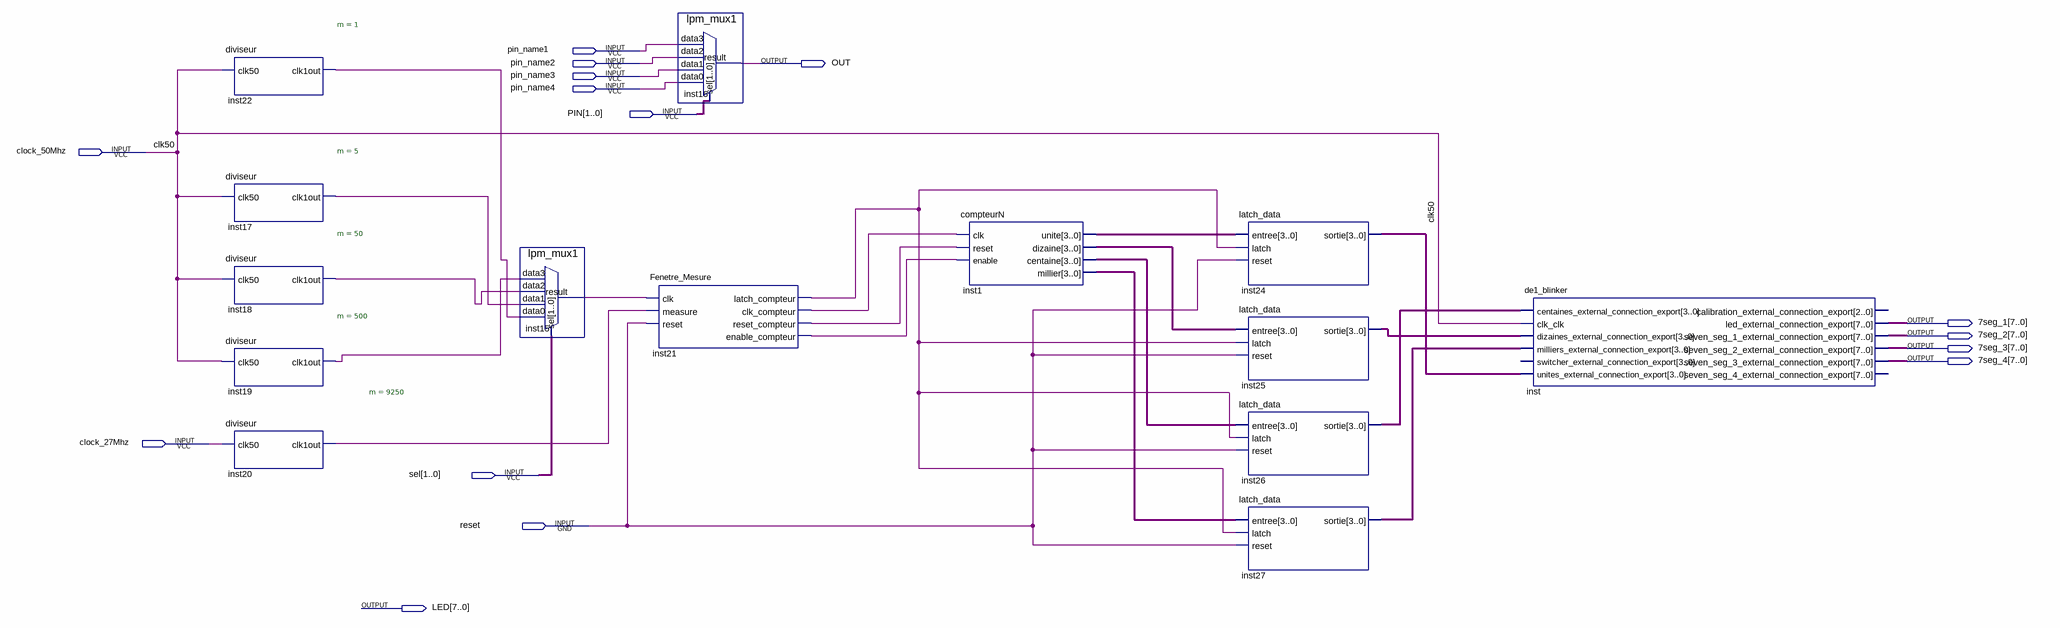
[diagram p0: schematic sheet]
// Quartus schematic Blinker_Schema.bdf as structural Verilog: 14 symbols, 15 pins
module Blinker_Schema (
  input  pin_name1,
  input  pin_name2,
  input  pin_name3,
  input  pin_name4,
  input  [1:0] PIN,
  input  clock_50Mhz,
  input  clock_27Mhz,
  input  [1:0] sel,
  input  reset,
  output OUT,
  output [7:0] \7seg_1 ,
  output [7:0] \7seg_2 ,
  output [7:0] \7seg_3 ,
  output [7:0] \7seg_4 ,
  output [7:0] LED
);

  wire inst15_result, inst17_clk1out, inst18_clk1out, inst19_clk1out, inst20_clk1out, inst21_clk_compteur,
       inst21_enable_compteur, inst21_latch_compteur, inst21_reset_compteur, inst22_clk1out;
  wire [3:0] inst1_centaine, inst1_dizaine, inst1_millier, inst1_unite, inst24_sortie, inst25_sortie,
       inst26_sortie, inst27_sortie;

  diviseur #(.m(1)) inst22 (.clk50(clock_50Mhz), .clk1out(inst22_clk1out));
  diviseur #(.m(5)) inst17 (.clk50(clock_50Mhz), .clk1out(inst17_clk1out));
  diviseur #(.m(50)) inst18 (.clk50(clock_50Mhz), .clk1out(inst18_clk1out));
  diviseur #(.m(500)) inst19 (.clk50(clock_50Mhz), .clk1out(inst19_clk1out));
  diviseur #(.m(9250)) inst20 (.clk50(clock_27Mhz), .clk1out(inst20_clk1out));
  lpm_mux1 inst15 (
    .data3(inst19_clk1out), .data2(inst18_clk1out), .data1(inst17_clk1out), .data0(inst22_clk1out),
    .sel(sel), .result(inst15_result));
  lpm_mux1 inst16 (.data3(pin_name1), .data2(pin_name2), .data1(pin_name3), .data0(pin_name4), .sel(PIN), .result(OUT));
  Fenetre_Mesure inst21 (
    .clk(inst15_result), .measure(inst20_clk1out), .reset(reset), .latch_compteur(inst21_latch_compteur),
    .clk_compteur(inst21_clk_compteur), .reset_compteur(inst21_reset_compteur),
    .enable_compteur(inst21_enable_compteur));
  compteurN inst1 (
    .clk(inst21_clk_compteur), .enable(inst21_enable_compteur), .reset(inst21_reset_compteur),
    .centaine(inst1_centaine), .dizaine(inst1_dizaine), .millier(inst1_millier), .unite(inst1_unite));
  latch_data inst24 (.entree(inst1_unite), .latch(inst21_latch_compteur), .reset(reset), .sortie(inst24_sortie));
  latch_data inst25 (.entree(inst1_dizaine), .latch(inst21_latch_compteur), .reset(reset), .sortie(inst25_sortie));
  latch_data inst26 (.entree(inst1_centaine), .latch(inst21_latch_compteur), .reset(reset), .sortie(inst26_sortie));
  latch_data inst27 (.entree(inst1_millier), .latch(inst21_latch_compteur), .reset(reset), .sortie(inst27_sortie));
  de1_blinker inst (
    .centaines_external_connection_export(inst26_sortie), .clk_clk(clock_50Mhz),
    .dizaines_external_connection_export(inst25_sortie), .milliers_external_connection_export(inst27_sortie),
    .unites_external_connection_export(inst24_sortie), .led_external_connection_export(\7seg_1 ),
    .seven_seg_1_external_connection_export(\7seg_2 ), .seven_seg_2_external_connection_export(\7seg_3 ),
    .seven_seg_3_external_connection_export(\7seg_4 ));  // open: switcher_external_connection_export, calibration_external_connection_export, seven_seg_4_external_connection_export

  // Other names for the same wires on the sheet: clk50 = clock_50Mhz
endmodule
